# Altium schematic sheet Sensors.SchDoc
size Letter; Organization: Altium Limited; Address1: L3, 12a Rodborough Rd; Address2: Frenchs Forest; Address3: NSW; Address4: Australia 2086
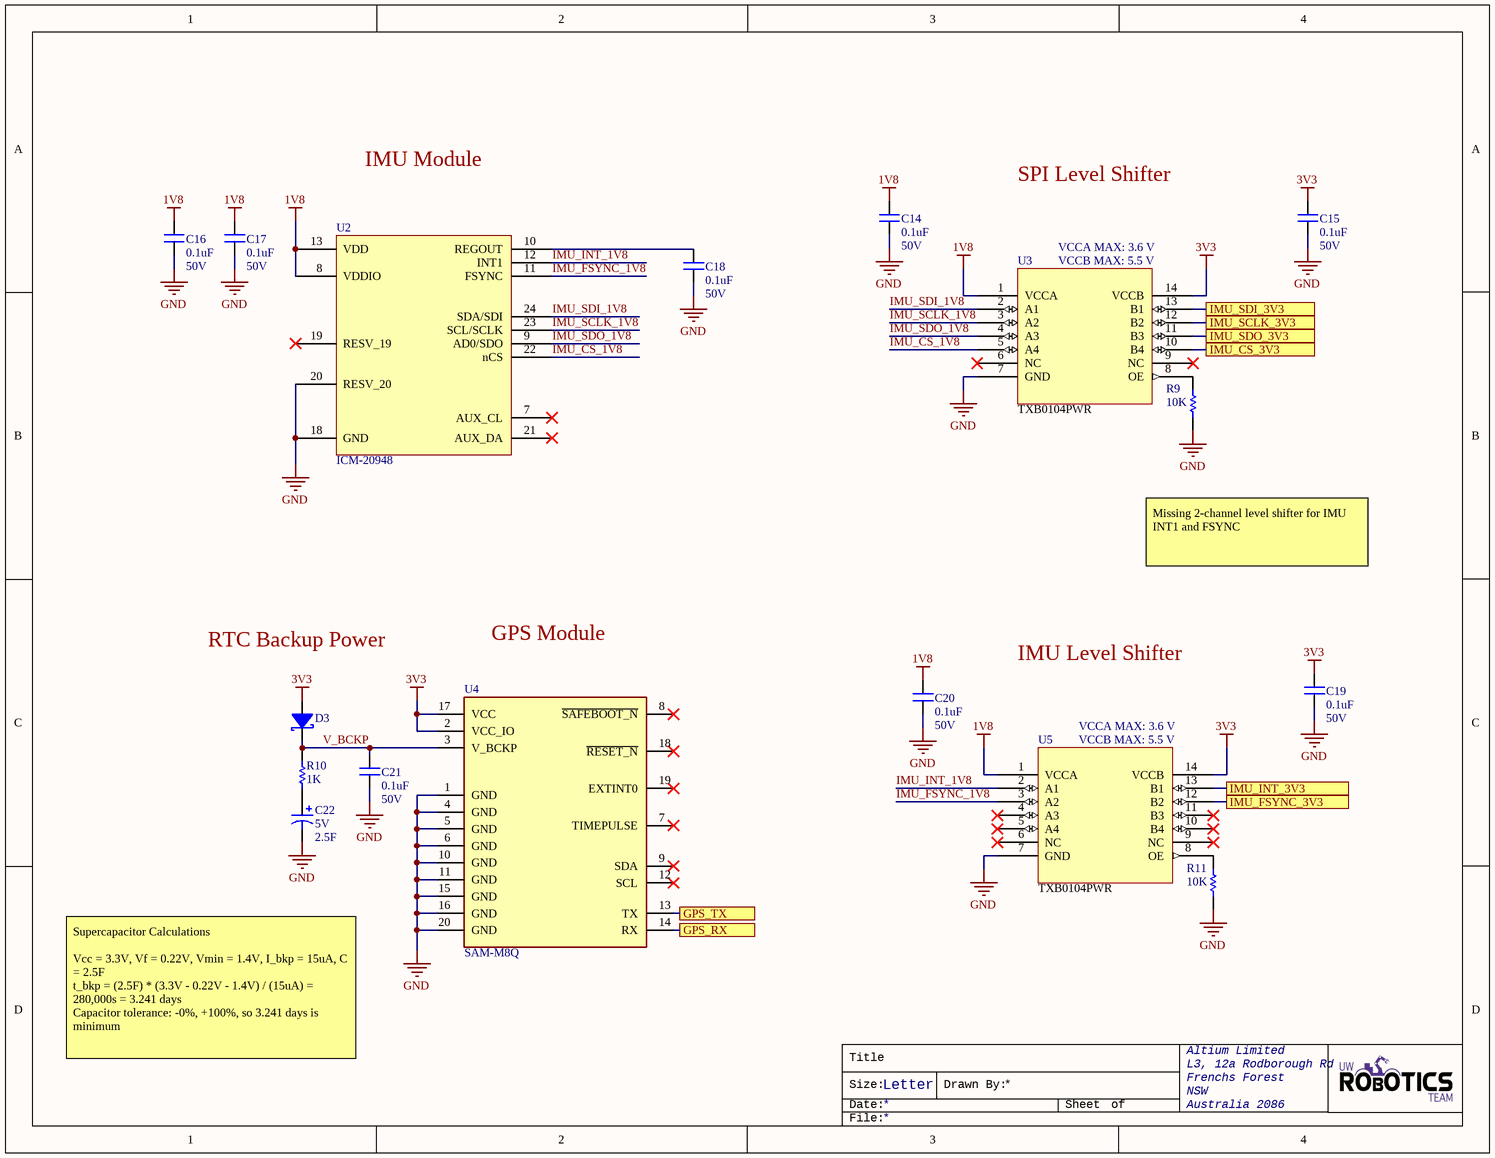
[diagram p0: Sensors.SchDoc]

## Parts
C14  value 0.1uF  Voltage Rating: 50V  [CAPC2012X140N]  (hidden comment: CAP_0.1uF_50V_0805)
C15  value 0.1uF  Voltage Rating: 50V  [CAPC2012X140N]  (hidden comment: CAP_0.1uF_50V_0805)
C16  value 0.1uF  Voltage Rating: 50V  [CAPC2012X140N]  (hidden comment: CAP_0.1uF_50V_0805)
C17  value 0.1uF  Voltage Rating: 50V  [CAPC2012X140N]  (hidden comment: CAP_0.1uF_50V_0805)
C18  value 0.1uF  Voltage Rating: 50V  [CAPC2012X140N]  (hidden comment: CAP_0.1uF_50V_0805)
C19  value 0.1uF  Voltage Rating: 50V  [CAPC2012X140N]  (hidden comment: CAP_0.1uF_50V_0805)
C20  value 0.1uF  Voltage Rating: 50V  [CAPC2012X140N]  (hidden comment: CAP_0.1uF_50V_0805)
C21  value 0.1uF  Voltage Rating: 50V  [CAPC2012X140N]  (hidden comment: CAP_0.1uF_50V_0805)
C22  Voltage Rating: 5V  Capacitance: 2.5F  (hidden comment: CAP_2.5F_5V)
D3  DIO_SCHOTTKY_30V_800mA  [DIO_CUS520,H3F]  (value not drawn)
R9  value 10K  [RESC0603(1608)_N]  (hidden comment: RES_10K_0603)
R10  value 1K  [RESC0603(1608)_N]  (hidden comment: RES_1K_0603)
R11  value 10K  [RESC0603(1608)_N]  (hidden comment: RES_10K_0603)
U2  IC_9DOF_IMU  [ICM-20948]  (value not drawn)
U3  VCCB MAX: VCCB MAX: 5.5 V  VCCA MAX: VCCA MAX: 3.6 V  [PW14]  (hidden comment: TXB0104PWR)
U4  SAM-M8Q
U5  VCCB MAX: VCCB MAX: 5.5 V  VCCA MAX: VCCA MAX: 3.6 V  [PW14]  (hidden comment: TXB0104PWR)

## Ports
GPS_RX, GPS_TX, IMU_CS_3V3, IMU_FSYNC_3V3, IMU_INT_3V3, IMU_SCLK_3V3, IMU_SDI_3V3, IMU_SDO_3V3

## Nets
1V8: C14.2 C16.2 C17.2 C20.2 U2.8(VDDIO) U2.13(VDD) U3.1(VCCA) U5.1(VCCA)
3V3: C15.2 C19.2 D3.1(Anode) U3.14(VCCB) U4.2(VCC_IO) U4.17(VCC) U5.14(VCCB)
GND: C14.1 C15.1 C16.1 C17.1 C18.1 C19.1 C20.1 C21.1 C22.2 R9.2 R11.2 U2.18(GND) U2.20(RESV_20) U3.7(GND) U4.1(GND) U4.4(GND) U4.5(GND) U4.6(GND) U4.10(GND) U4.11(GND) U4.15(GND) U4.16(GND) U4.20(GND) U5.7(GND)
GPS_RX: U4.14(RX) ; port GPS_RX
GPS_TX: U4.13(TX) ; port GPS_TX
IMU_CS_1V8: U2.22(nCS) U3.5(A4)
IMU_CS_3V3: U3.10(B4) ; port IMU_CS_3V3
IMU_FSYNC_1V8: U2.11(FSYNC) U5.3(A2)
IMU_FSYNC_3V3: U5.12(B2) ; port IMU_FSYNC_3V3
IMU_INT_1V8: U2.12(INT1) U5.2(A1)
IMU_INT_3V3: U5.13(B1) ; port IMU_INT_3V3
IMU_SCLK_1V8: U2.23(SCL/SCLK) U3.3(A2)
IMU_SCLK_3V3: U3.12(B2) ; port IMU_SCLK_3V3
IMU_SDI_1V8: U2.24(SDA/SDI) U3.2(A1)
IMU_SDI_3V3: U3.13(B1) ; port IMU_SDI_3V3
IMU_SDO_1V8: U2.9(AD0/SDO) U3.4(A3)
IMU_SDO_3V3: U3.11(B3) ; port IMU_SDO_3V3
V_BCKP: C21.2 D3.2(Cathode) R10.1 U4.3(V_BCKP)
NetC18_2: C18.2 U2.10(REGOUT)
NetC22_1: C22.1 R10.2
NetR9_1: R9.1 U3.8(OE)
NetR11_1: R11.1 U5.8(OE)

Not connected (* = marked no-connect by the designer): U2 7(AUX_CL)* 19(RESV_19)* 21(AUX_DA)*; U3 6(NC)* 9(NC)*; U4 7(TIMEPULSE)* 8(~{SAFEBOOT_N})* 9(SDA)* 12(SCL)* 18(~{RESET_N})* 19(EXTINT0)*; U5 4(A3)* 5(A4)* 6(NC)* 9(NC)* 10(B4)* 11(B3)*

## Notes on the sheet
- IMU Module
- SPI Level Shifter
- Missing 2-channel level shifter for IMU INT1 and FSYNC
- GPS Module
- RTC Backup Power
- IMU Level Shifter
- Supercapacitor Calculations
  Vcc = 3.3V, Vf = 0.22V, Vmin = 1.4V, I_bkp = 15uA, C = 2.5F
  t_bkp = (2.5F) * (3.3V - 0.22V - 1.4V) / (15uA) = 280,000s = 3.241 days
  Capacitor tolerance: -0%, +100%, so 3.241 days is minimum
- Title
- Size:
- Date:
- Letter
- Drawn By:
- Sheet
- of
- File:

## Library data of the parts
C14-C21 = CAP_0.1uF_50V_0805: CAP CER 0.1UF 50V X7R 0805; Manufacturer 1: Murata; Manufacturer Part Number 1: GCD21BR71H104KA01L; Capacitance: 100nF; Tolerance: 10%; Mount: Surface Mount; Case/Package: 0805; Case Code (Metric): 2012; Case Code (Imperial): 0805; Min Operating Temperature: -55°C; Max Operating Temperature: 125°C; Dielectric: X7R; Termination: SMD/SMT; Length: 2mm; Height: 1.25mm; Width: 0.049inch; Thickness: 0.049inch; Depth: 1.25mm; Ratings: AEC-Q200; ComponentLink1URL: https://datasheet.ciiva.com/29537/c03e-29537701.pdf?src-supplier=Digi-Key; ComponentLink1Description: https://datasheet.ciiva.com/29537/c03e-29537701.pdf?src-supplier=Digi-Key; Supplier 1: Digi-Key; Supplier Part Number 1: 490-11955-1-ND
C22 = CAP_2.5F_5V: CAP 2.5F 5V; Manufacturer 1: AVX Corporation; Manufacturer Part Number 1: SCMS22C255PRBA0; Tolerance: 0%, +100%; RoHS: Yes; Mount: Through Hole; Case/Package: Radial; Min Operating Temperature: -40°C; Max Operating Temperature: 85°C; Voltage Rating (DC): 5V; Dimensions: 0.787" L x 0.394" W (20.00mm x 10.00mm); Height - Seated (Max): 0.925" (23.50mm); Supplier 1: Digi-Key
D3 = DIO_SCHOTTKY_30V_800mA: DIODE SCHOTTKY 30V 800MA USC; Manufacturer 1: Toshiba Semiconductor and Storage; Manufacturer Part Number 1: CUS08F30,H3F; Vf (Max): 220mV; Supplier 1: Digi-Key; Supplier Part Number 1: CUS08F30H3FCT-ND; Mount: Surface Mount; Vr (Max): 30V; Io: 800mA
R9 R11 = RES_10K_0603: RES SMD 10K OHM 5% 1/10W 0603; Manufacturer 1: Yageo; Manufacturer Part Number 1: RC0603JR-0710KL; Package: 0603 (1608 Metric); Dimensions: 0.063" L x 0.031" W (1.60mm x 0.80mm); Tolerance: 5%; Supplier Part Number 1: 311-10KGRCT-ND; Supplier 1: Digi-Key; Mount: Surface Mount
R10 = RES_1K_0603: RES SMD 1K OHM 5% 1/10W 0603; Manufacturer 1: Yageo; Manufacturer Part Number 1: RC0603JR-071KL; Dimensions: 0.063" L x 0.031" W (1.60mm x 0.80mm); Tolerance: 5%; Package: 0603 (1608 Metric); Supplier Part Number 1: 311-1.0KGRCT-ND; Supplier 1: Digi-Key; Mount: Surface Mount
U2 = IC_9DOF_IMU: IMU ACCEL/GYRO/COMPI2C/SPI 24QFN; Manufacturer: TDK InvenSense; Sensor Type: Accelerometer,Gyroscope,Magnetometer; Output Type: SPI,I2C; Supplier 1: Digi-Key; RoHS: No; Category: Inertial Measurement Units (IMUs); Stock 1: 21985; Pricing 1: 1=8.04000, 5=7.09600, 10=6.26700, 25=5.08480, 50=4.49360, 100=4.37530, 500=3.66576, 1000=3.42925 (USD); Mount: Surface Mount; Case/Package: QFN; Min Operating Temperature: -40°C; Max Operating Temperature: 85°C; Packaging: Tape and Reel; ComponentLink1URL: http://www.farnell.com/datasheets/2632662.pdf?src-supplier=Farnell; ComponentLink1Description: http://www.farnell.com/datasheets/2632662.pdf?src-supplier=Farnell; ComponentLink2URL: https://www.invensense.com/wp-content/uploads/2016/06/App-Note-eMD-20x48-User-Guide.pdf?src-supplier=Digi-Key; ComponentLink2Description: https://www.invensense.com/wp-content/uploads/2016/06/App-Note-eMD-20x48-User-Guide.pdf?src-supplier=Digi-Key; ComponentLink3URL: https://www.invensense.com/wp-content/uploads/2016/06/App-Note-eMD-20x48-User-Guide.pdf?src-supplier=Avnet+Europe; ComponentLink3Description: https://www.invensense.com/wp-content/uploads/2016/06/App-Note-eMD-20x48-User-Guide.pdf?src-supplier=Avnet+Europe; ComponentLink4URL: http://www.farnell.com/datasheets/2632662.pdf?src-supplier=Element14; ComponentLink4Description: http://www.farnell.com/datasheets/2632662.pdf?src-supplier=Element14; ComponentLink5URL: https://www.invensense.com/wp-content/uploads/2016/06/App-Note-eMD-20x48-User-Guide.pdf?src-supplier=Avnet; ComponentLink5Description: https://www.invensense.com/wp-content/uploads/2016/06/App-Note-eMD-20x48-User-Guide.pdf?src-supplier=Avnet; ComponentLink6URL: https://www.invensense.com/wp-content/uploads/2016/06/App-Note-eMD-20x48-User-Guide.pdf?src-supplier=Component+Distributors+Inc.; ComponentLink6Description: https://www.invensense.com/wp-content/uploads/2016/06/App-Note-eMD-20x48-User-Guide.pdf?src-supplier=Component+Distributors+Inc.; Supplier Part Number 1: 1428-1123-1-ND; Manufacturer Part Number: ICM-20948
U3 U5 = IC_4CH_LVL_SHIFTER: 4-Bit Bidirectional Voltage-Level Translator with Auto Direction Sensing / VCCA < VCCB, see datasheet; Vendor: Texas Instruments; PACKAGE_DESIGNATOR: PW; PIN_COUNT: 14; FAMILY_NAME: AUTO DIRECTION SENSING DUAL SUPPLY TRANSLATOR; INDUSTRY_STD_PKG_TYPE: TSSOP; Manufacturer_Part_Number: TXB0104PWR; GENERIC_PART_NUMBER: TXB0104; Datasheet_URL: http://www.ti.com/lit/gpn/TXB0104; Manufacturer: Texas Instruments; Supplier 1: Digi-Key; Supplier Part Number 1: 296-21929-1-ND
U4 = SAM-M8Q: Rf Rx Galileo 1.575GHZ/1.602GHZ; Manufacturer 1: u-blox; Manufacturing Part Number 1: SAM-M8Q-0-10; Interface: I2C,SPI,USB,UART; Sensitivity: -165dBm; Data Rate: 400Kbps; Supplier 1: Digi-Key; RoHS: No; Stock 1: 2191; Pricing 1: 1=25.00000, 10=20.24400, 50=16.62160, 100=13.26160 (USD); Case/Package: SMD/SMT; Min Operating Temperature: -40°C; Max Operating Temperature: 85°C; Packaging: Tape and Reel; Frequency: 1.602GHz; ComponentLink1URL: https://www.u-blox.com/sites/default/files/SAM-M8Q_ProductSummary_%28UBX-15027452%29.pdf?src-supplier=Digi-Key; ComponentLink1Description: https://www.u-blox.com/sites/default/files/SAM-M8Q_ProductSummary_%28UBX-15027452%29.pdf?src-supplier=Digi-Key; ComponentLink2URL: https://www.u-blox.com/sites/default/files/SAM-M8Q_DataSheet_%28UBX-16012619%29.pdf?src-supplier=Digi-Key; ComponentLink2Description: https://www.u-blox.com/sites/default/files/SAM-M8Q_DataSheet_%28UBX-16012619%29.pdf?src-supplier=Digi-Key; Supplier Part Number 1: 672-1054-1-ND